# EAGLE schematic thumper_v0001 (EAGLE 6.4)

## Sheet 1 of 3
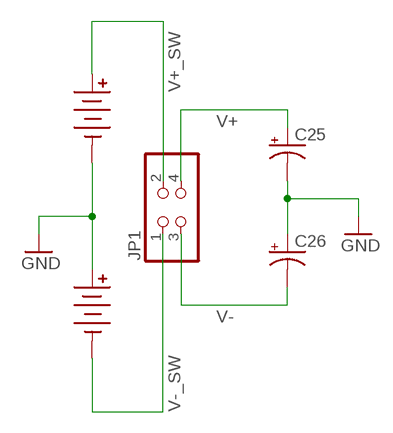
[diagram p0: schematic, sheet 1]

### Parts
BATT1  BATT_9V  [9V_FEMALE]
BATT2  BATT_9V  [9V_FEMALE]
C25  CPOL-US153CLV-1010  [153CLV-1010]
C26  CPOL-US153CLV-1010  [153CLV-1010]
JP1  PINHD-2X2  [2X02]

### Nets
GND: BATT1.N1(NEG) BATT1.N2(NEG) BATT1.N3(NEG) BATT2.P1(POS) BATT2.P2(POS) BATT2.P3(POS) C25.- C26.+ ; also sheet 2,3
V+: C25.+ JP1.4 ; also sheet 2,3
V+_SW: BATT1.P1(POS) BATT1.P2(POS) BATT1.P3(POS) JP1.2
V-: C26.- JP1.3 ; also sheet 2,3
V-_SW: BATT2.N1(NEG) BATT2.N2(NEG) BATT2.N3(NEG) JP1.1

## Sheet 2 of 3
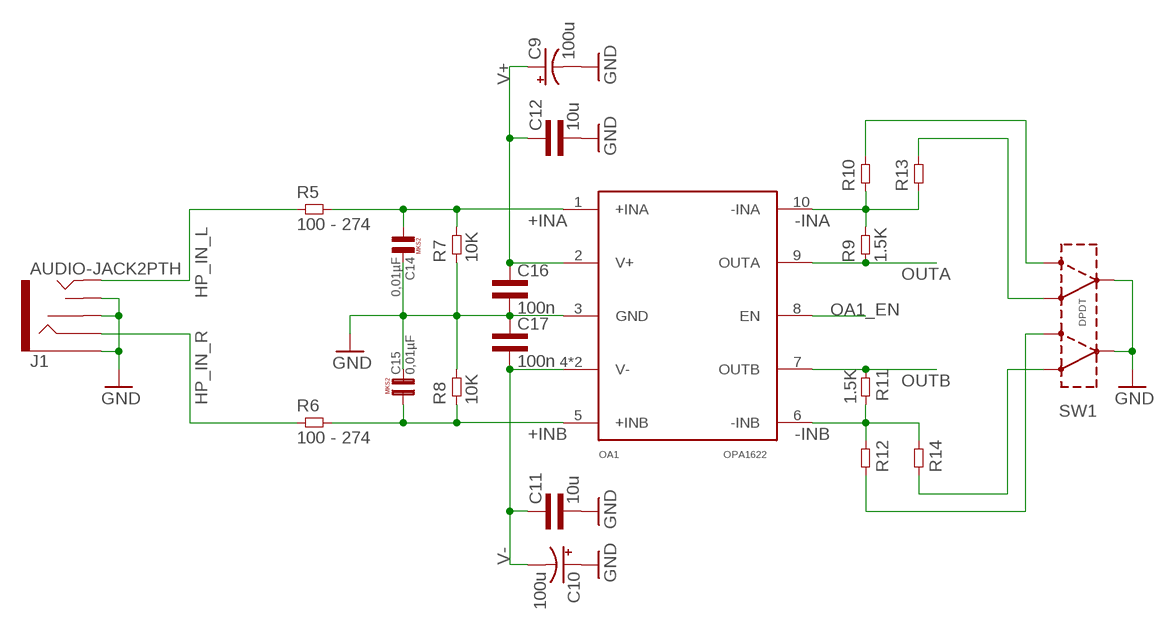
[diagram p1: schematic, sheet 2]

### Parts
C9  100u  CPOL-USCT7343  [CT7343]
C10  100u  CPOL-USCT7343  [CT7343]
C11  10u  CAP0805L3  [0805L3]
C12  10u  CAP0805L3  [0805L3]
C14  0,01µF  [R5B2K5]
C15  0,01µF  [R5B2K5]
C16  100n  CAP0603L3  [0603L3]
C17  100n  CAP0603L3  [0603L3]
J1  AUDIO-JACK2PTH  [AUDIO-JACK]
OA1  OPA1622  [S-PVSON-N10]
R5  100 - 274  RES0603L3  [0603L3]
R6  100 - 274  RES0603L3  [0603L3]
R7  10K  RES0603L3  [0603L3]
R8  10K  RES0603L3  [0603L3]
R9  1.5K  RES0603L3  [0603L3]
R10  RES0603L3  [0603L3]
R11  1.5K  RES0603L3  [0603L3]
R12  RES0603L3  [0603L3]
R13  RES0603L3  [0603L3]
R14  RES0603L3  [0603L3]
SW1  DPDTDPDT-2X2.5  [DPDT-2X2.5]

### Nets
+INA: C14.1 OA1.1(+INA) R5.P$2 R7.P$2
+INB: C15.1 OA1.5(+INB) R6.P$2 R8.P$1
-INA: OA1.10(-INA) R9.P$2 R10.P$1 R13.P$1
-INB: OA1.6(-INB) R11.P$2 R12.P$1 R14.P$1
GND: C9.- C10.+ C11.2 C12.2 C14.2 C15.2 C16.P$2 C17.P$1 J1.RSH J1.SLEEVE J1.TSH OA1.3(GND) R7.P$1 R8.P$2 SW1.2(INA) SW1.5(INB) ; also sheet 1,3
HP_IN_L: J1.TIP R5.P$1
HP_IN_R: J1.RING R6.P$1
N$1: R10.P$2 SW1.6(OUTB2)
N$2: R12.P$2 SW1.3(OUTA2)
N$3: R13.P$2 SW1.4(OUTB1)
N$4: R14.P$2 SW1.1(OUTA1)
OA1_EN: OA1.8(EN)
OUTA: OA1.9(OUTA) R9.P$1 ; also sheet 3
OUTB: OA1.7(OUTB) R11.P$1 ; also sheet 3
V+: C9.+ C12.1 C16.P$1 OA1.2(V+) ; also sheet 1,3
V-: C10.- C11.1 C17.P$2 OA1.4(V-) OA1.TP(V-) ; also sheet 1,3

## Sheet 3 of 3
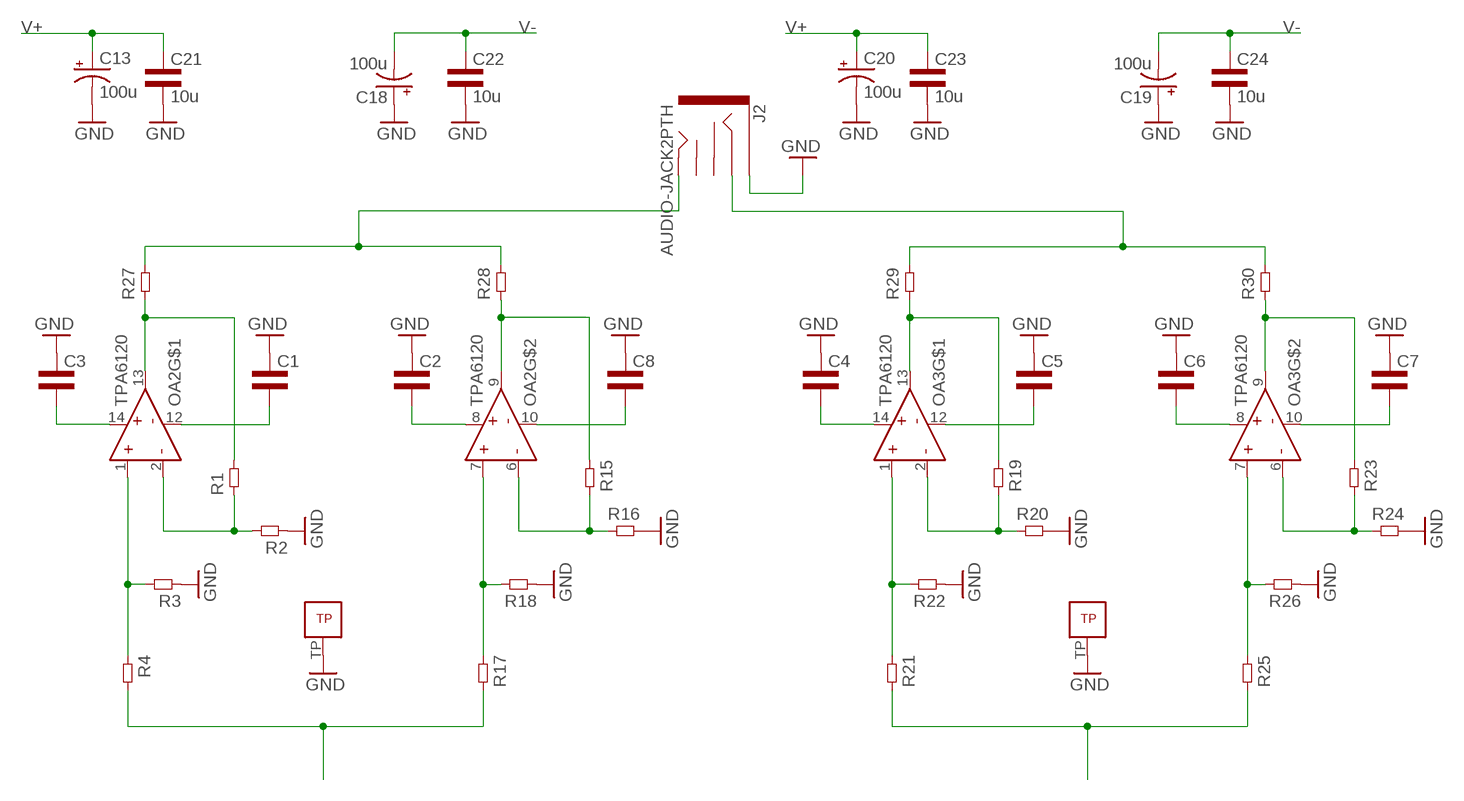
[diagram p2: schematic, sheet 3]

### Parts
C1  CAP0603L3  [0603L3]
C2  CAP0603L3  [0603L3]
C3  CAP0603L3  [0603L3]
C4  CAP0603L3  [0603L3]
C5  CAP0603L3  [0603L3]
C6  CAP0603L3  [0603L3]
C7  CAP0603L3  [0603L3]
C8  CAP0603L3  [0603L3]
C13  100u  CPOL-USCT7343  [CT7343]
C18  100u  CPOL-USCT7343  [CT7343]
C19  100u  CPOL-USCT7343  [CT7343]
C20  100u  CPOL-USCT7343  [CT7343]
C21  10u  CAP0805L3  [0805L3]
C22  10u  CAP0805L3  [0805L3]
C23  10u  CAP0805L3  [0805L3]
C24  10u  CAP0805L3  [0805L3]
J2  AUDIO-JACK2PTH  [AUDIO-JACK]
OA2  TPA6120QFN  [S-PVQFN-N14]
OA3  TPA6120QFN  [S-PVQFN-N14]
R1  RES0603L3  [0603L3]
R2  RES0603L3  [0603L3]
R3  RES0603L3  [0603L3]
R4  RES0603L3  [0603L3]
R15  RES0603L3  [0603L3]
R16  RES0603L3  [0603L3]
R17  RES0603L3  [0603L3]
R18  RES0603L3  [0603L3]
R19  RES0603L3  [0603L3]
R20  RES0603L3  [0603L3]
R21  RES0603L3  [0603L3]
R22  RES0603L3  [0603L3]
R23  RES0603L3  [0603L3]
R24  RES0603L3  [0603L3]
R25  RES0603L3  [0603L3]
R26  RES0603L3  [0603L3]
R27  RES0805L3  [0805L3]
R28  RES0805L3  [0805L3]
R29  RES0805L3  [0805L3]
R30  RES0805L3  [0805L3]

### Nets
GND: C1.P$1 C2.P$1 C3.P$1 C4.P$1 C5.P$1 C6.P$1 C7.P$1 C8.P$1 C13.- C18.+ C19.+ C20.- C21.2 C22.2 C23.2 C24.2 J2.SLEEVE OA2.TP OA3.TP R2.P$1 R3.P$1 R16.P$2 R18.P$1 R20.P$2 R22.P$1 R24.P$2 R26.P$1 ; also sheet 1,2
N$5: OA2.1(IN+) R3.P$2 R4.P$1
N$6: OA2.2(IN-) R1.P$1 R2.P$2
N$7: OA2.13(OUT) R1.P$2 R27.1
N$8: OA3.1(IN+) R21.P$1 R22.P$2
N$9: OA3.2(IN-) R19.P$2 R20.P$1
N$10: OA3.13(OUT) R19.P$1 R29.1
N$11: OA3.7(IN+) R25.P$1 R26.P$2
N$12: OA3.6(IN-) R23.P$2 R24.P$1
N$13: OA3.9(OUT) R23.P$1 R30.1
N$14: OA2.6(IN-) R15.P$2 R16.P$1
N$15: OA2.7(IN+) R17.P$1 R18.P$2
N$16: OA2.9(OUT) R15.P$1 R28.1
N$22: J2.TIP R27.2 R28.2
N$23: J2.RING R29.2 R30.2
OUTA: R4.P$2 R17.P$2 ; also sheet 2
OUTB: R21.P$2 R25.P$2 ; also sheet 2
V+: C2.P$2 C3.P$2 C4.P$2 C6.P$2 C13.+ C20.+ C21.1 C23.1 OA2.8(V+) OA2.14(V+) OA3.8(V+) OA3.14(V+) ; also sheet 1,2
V-: C1.P$2 C5.P$2 C7.P$2 C8.P$2 C18.- C19.- C22.1 C24.1 OA2.10(V-) OA2.12(V-) OA3.10(V-) OA3.12(V-) ; also sheet 1,2
Unconnected: J2.RSH J2.TSH

## Library data of the parts
BATT1 BATT2 = common:BATT_9V: 9V Battery
C1-C8 C11 C12 C16 C17 C21-C24 = common:CAP
C9 C10 C13 C18-C20 C25 C26 = rcl:CPOL-US: POLARIZED CAPACITOR, American symbol
C14 C15 = Capacitor-Wima-MKS2-63v:0,01µF
J1 J2 = SparkFun-Connectors:AUDIO-JACK2: Stereo audio jack with bypass switches. Used on LilyPad MP3 board. Production SKU: CONN-10353
JP1 = pinhead:PINHD-2X2: PIN HEADER
OA1 = common:OPA1622
OA2 OA3 = common:TPA6120
R1-R30 = common:RES
SW1 = common:DPDT